# Altium schematic sheet Sheet1.SchDoc
size A4
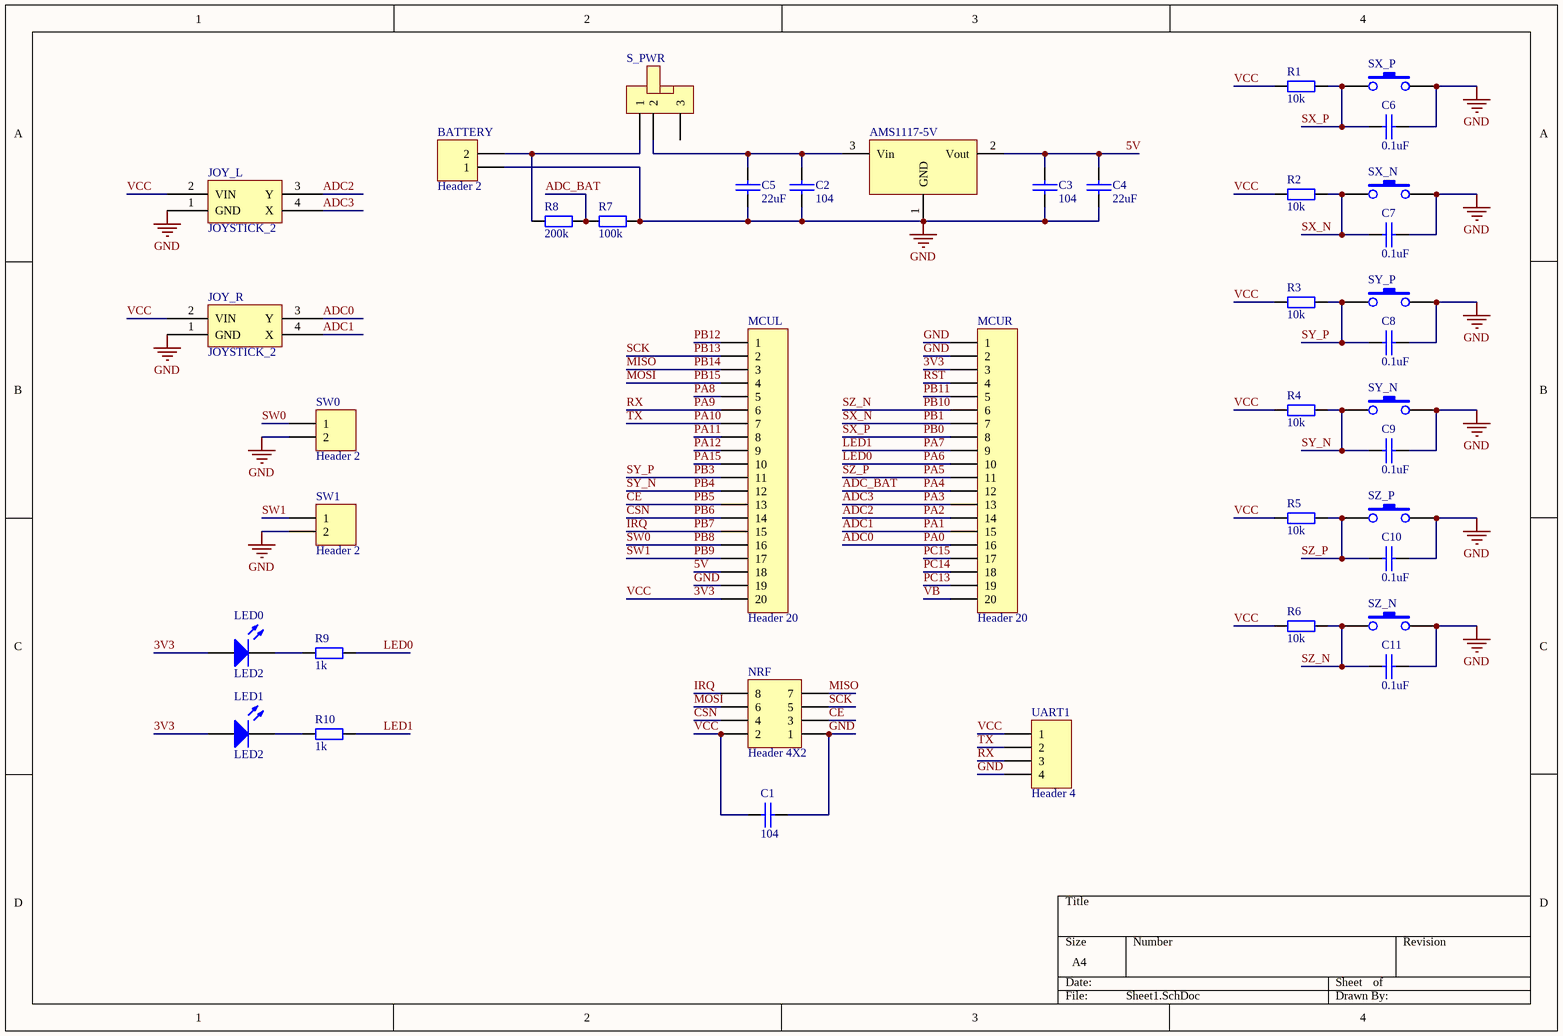
[diagram p0: Sheet1.SchDoc]

## Parts
AMS1117-5V  AMS1117  [SOT-223]  (value not drawn)
BATTERY  Header 2  [HDR1X2]
C1  value 104  [C1608[0603]N]  (hidden comment: cap smd)
C2  value 104  [C1608[0603]N]  (hidden comment: cap smd)
C3  value 104  [C1608[0603]N]  (hidden comment: cap smd)
C4  value 22uF  [C2012[0805]N]  (hidden comment: cap smd)
C5  value 22uF  [C2012[0805]N]  (hidden comment: cap smd)
C6  value 0.1uF  [C1608[0603]N]  (hidden comment: cap smd)
C7  value 0.1uF  [C1608[0603]N]  (hidden comment: cap smd)
C8  value 0.1uF  [C1608[0603]N]  (hidden comment: cap smd)
C9  value 0.1uF  [C1608[0603]N]  (hidden comment: cap smd)
C10  value 0.1uF  [C1608[0603]N]  (hidden comment: cap smd)
C11  value 0.1uF  [C1608[0603]N]  (hidden comment: cap smd)
JOY_L  JOYSTICK_2  [JOYSTICK_2]
JOY_R  JOYSTICK_2  [JOYSTICK_2]
LED0  LED2  [3.2X1.6X1.1]
LED1  LED2  [3.2X1.6X1.1]
MCUL  Header 20  [HDR1X20]
MCUR  Header 20  [HDR1X20]
NRF  Header 4X2  [HDR2X4]
R1  value 10k  [R1608[0603]]  (hidden comment: RES1)
R2  value 10k  [R1608[0603]]  (hidden comment: RES1)
R3  value 10k  [R1608[0603]]  (hidden comment: RES1)
R4  value 10k  [R1608[0603]]  (hidden comment: RES1)
R5  value 10k  [R1608[0603]]  (hidden comment: RES1)
R6  value 10k  [R1608[0603]]  (hidden comment: RES1)
R7  value 100k  [R1608[0603]]  (hidden comment: RES1)
R8  value 200k  [R1608[0603]]  (hidden comment: RES1)
R9  value 1k  [R1608[0603]]  (hidden comment: RES1)
R10  value 1k  [R1608[0603]]  (hidden comment: RES1)
S_PWR  3脚拨动开关侧  [3脚拨动开关侧]  (value not drawn)
SW0  Header 2  [HDR1X2]
SW1  Header 2  [HDR1X2]
SX_N  (no value)  [SW]
SX_P  (no value)  [SW]
SY_N  (no value)  [SW]
SY_P  (no value)  [SW]
SZ_N  (no value)  [SW]
SZ_P  (no value)  [SW]
UART1  Header 4  [HDR1X4]

## Nets
GND: AMS1117-5V.1(GND) BATTERY.1 C1.2 C2.2 C3.2 C4.2 C5.2 C6.2 C7.2 C8.2 C9.2 C10.2 C11.2 JOY_L.1(GND) JOY_R.1(GND) MCUL.19 MCUR.1 MCUR.2 NRF.1 R7.1 SW0.2 SW1.2 SX_N.2 SX_P.2 SY_N.2 SY_P.2 SZ_N.2 SZ_P.2 UART1.4
3V3: C1.1 JOY_L.2(VIN) JOY_R.2(VIN) LED0.1(A) LED1.1(A) MCUL.20 MCUR.3 NRF.2 R1.2 R2.2 R3.2 R4.2 R5.2 R6.2 UART1.1  [also labelled VCC]
5V: AMS1117-5V.2(Vout) C3.1 C4.1 MCUL.18
ADC0: JOY_R.3(Y) MCUR.16  [also labelled PA0]
ADC1: JOY_R.4(X) MCUR.15  [also labelled PA1]
ADC2: JOY_L.3(Y) MCUR.14  [also labelled PA2]
ADC3: JOY_L.4(X) MCUR.13  [also labelled PA3]
ADC_BAT: MCUR.12 R7.2 R8.1  [also labelled PA4]
CE: MCUL.13 NRF.3  [also labelled PB5]
CSN: MCUL.14 NRF.4  [also labelled PB6]
IRQ: MCUL.15 NRF.8  [also labelled PB7]
LED0: MCUR.10 R9.1  [also labelled PA6]
LED1: MCUR.9 R10.1  [also labelled PA7]
MISO: MCUL.3 NRF.7  [also labelled PB14]
MOSI: MCUL.4 NRF.6  [also labelled PB15]
PA5: C10.1 MCUR.11 R5.1 SZ_P.1  [also labelled SZ_P]
PA8: MCUL.5
PA9: MCUL.6 UART1.3  [also labelled RX]
PA10: MCUL.7 UART1.2  [also labelled TX]
PA11: MCUL.8
PA12: MCUL.9
PA15: MCUL.10
PB0: C6.1 MCUR.8 R1.1 SX_P.1  [also labelled SX_P]
PB1: C7.1 MCUR.7 R2.1 SX_N.1  [also labelled SX_N]
PB3: C8.1 MCUL.11 R3.1 SY_P.1  [also labelled SY_P]
PB4: C9.1 MCUL.12 R4.1 SY_N.1  [also labelled SY_N]
PB8: MCUL.16 SW0.1  [also labelled SW0]
PB9: MCUL.17 SW1.1  [also labelled SW1]
PB10: C11.1 MCUR.6 R6.1 SZ_N.1  [also labelled SZ_N]
PB11: MCUR.5
PB12: MCUL.1
PB13: MCUL.2 NRF.5  [also labelled SCK]
PC13: MCUR.19
PC14: MCUR.18
PC15: MCUR.17
RST: MCUR.4
VB: MCUR.20
NetAMS1117-5V_3: AMS1117-5V.3(Vin) C2.1 C5.1 S_PWR.2
NetBATTERY_2: BATTERY.2 R8.2 S_PWR.1
NetLED0_2: LED0.2(K) R9.2
NetLED1_2: LED1.2(K) R10.2

Not connected (* = marked no-connect by the designer): S_PWR 3

## Library data of the parts
AMS1117-5V = AMS1117: 2/4端口均输出3.3V
BATTERY SW0 SW1 = Header 2: Header, 2-Pin; LatestRevisionDate: 17-Jul-2002; LatestRevisionNote: Re-released for DXP Platform.; Publisher: Altium Limited
C1-C11 = CAP: 贴片无极性电容
LED0 LED1 = LED2: Typical RED, GREEN, YELLOW, AMBER GaAs LED; Published: 8-Jun-2000; LatestRevisionDate: 17-Jul-2002; LatestRevisionNote: Re-released for DXP Platform.; PackageDocument: Feb-2002; PackageReference: 3.2X1.6X1.1; Publisher: Altium Limited
MCUL MCUR = Header 20: Header, 20-Pin; LatestRevisionDate: 17-Jul-2002; LatestRevisionNote: Re-released for DXP Platform.; Publisher: Altium Limited
NRF = Header 4X2: Header, 4-Pin, Dual row; LatestRevisionDate: 17-Jul-2002; LatestRevisionNote: Re-released for DXP Platform.; Publisher: Altium Limited
SX_N SX_P SY_N SY_P SZ_N SZ_P = SW
UART1 = Header 4: Header, 4-Pin; LatestRevisionDate: 17-Jul-2002; LatestRevisionNote: Re-released for DXP Platform.; Publisher: Altium Limited